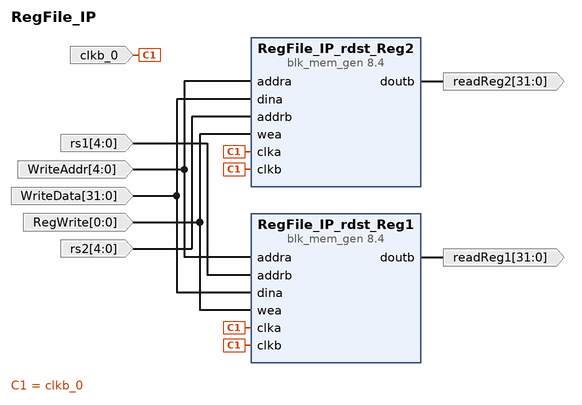
[diagram p0: block diagram of the top level]
# Vivado block design RegFile_IP, xc7z010clg400-1, Vivado 2023.2
create_bd_design RegFile_IP

create_bd_port -dir I -type clk clkb_0
create_bd_port -dir O -from 31 -to 0 readReg2
create_bd_port -dir I -from 4 -to 0 rs2
create_bd_port -dir I -from 0 -to 0 RegWrite
create_bd_port -dir I -from 31 -to 0 WriteData
create_bd_port -dir I -from 4 -to 0 WriteAddr
create_bd_port -dir O -from 31 -to 0 readReg1
create_bd_port -dir I -from 4 -to 0 rs1

create_bd_cell -type ip -vlnv xilinx.com:ip:blk_mem_gen:8.4 RegFile_IP_rdst_Reg1
set_property -dict [list \
  CONFIG.Assume_Synchronous_Clk true \
  CONFIG.Coe_File ../../RegFileInit.coe \
  CONFIG.Enable_32bit_Address false \
  CONFIG.Enable_A Always_Enabled \
  CONFIG.Enable_B Always_Enabled \
  CONFIG.Fill_Remaining_Memory_Locations true \
  CONFIG.Load_Init_File true \
  CONFIG.Memory_Type Simple_Dual_Port_RAM \
  CONFIG.Operating_Mode_A READ_FIRST \
  CONFIG.Port_B_Clock 100 \
  CONFIG.Port_B_Enable_Rate 100 \
  CONFIG.Register_PortB_Output_of_Memory_Primitives false \
  CONFIG.Use_Byte_Write_Enable false \
  CONFIG.Write_Depth_A 32 \
  CONFIG.use_bram_block Stand_Alone \
] [get_bd_cells RegFile_IP_rdst_Reg1]
create_bd_cell -type ip -vlnv xilinx.com:ip:blk_mem_gen:8.4 RegFile_IP_rdst_Reg2
set_property -dict [list \
  CONFIG.Assume_Synchronous_Clk true \
  CONFIG.Coe_File ../../RegFileInit.coe \
  CONFIG.Enable_32bit_Address false \
  CONFIG.Enable_A Always_Enabled \
  CONFIG.Enable_B Always_Enabled \
  CONFIG.Fill_Remaining_Memory_Locations true \
  CONFIG.Load_Init_File true \
  CONFIG.Memory_Type Simple_Dual_Port_RAM \
  CONFIG.Operating_Mode_A READ_FIRST \
  CONFIG.Port_B_Clock 100 \
  CONFIG.Port_B_Enable_Rate 100 \
  CONFIG.Register_PortB_Output_of_Memory_Primitives false \
  CONFIG.Use_Byte_Write_Enable false \
  CONFIG.Write_Depth_A 32 \
  CONFIG.use_bram_block Stand_Alone \
] [get_bd_cells RegFile_IP_rdst_Reg2]

# ---- connections ----

connect_bd_net [get_bd_pins RegFile_IP_rdst_Reg1/doutb] [get_bd_ports readReg1]
connect_bd_net [get_bd_pins RegFile_IP_rdst_Reg2/doutb] [get_bd_ports readReg2]
connect_bd_net -net addra_0_1 [get_bd_ports WriteAddr] [get_bd_pins RegFile_IP_rdst_Reg1/addra] [get_bd_pins RegFile_IP_rdst_Reg2/addra]
connect_bd_net -net addrb_0_1 [get_bd_ports rs2] [get_bd_pins RegFile_IP_rdst_Reg2/addrb]
connect_bd_net -net addrb_0_2 [get_bd_ports rs1] [get_bd_pins RegFile_IP_rdst_Reg1/addrb]
connect_bd_net -net clkb_0_1 [get_bd_ports clkb_0] \
  [get_bd_pins RegFile_IP_rdst_Reg1/clka] [get_bd_pins RegFile_IP_rdst_Reg1/clkb] [get_bd_pins RegFile_IP_rdst_Reg2/clka] \
  [get_bd_pins RegFile_IP_rdst_Reg2/clkb]
connect_bd_net -net dina_0_1 [get_bd_ports WriteData] [get_bd_pins RegFile_IP_rdst_Reg1/dina] [get_bd_pins RegFile_IP_rdst_Reg2/dina]
connect_bd_net -net wea_0_1 [get_bd_ports RegWrite] [get_bd_pins RegFile_IP_rdst_Reg1/wea] [get_bd_pins RegFile_IP_rdst_Reg2/wea]

validate_bd_design
save_bd_design
